# EAGLE design ardSCSInoV2 (EAGLE 7.7.0)
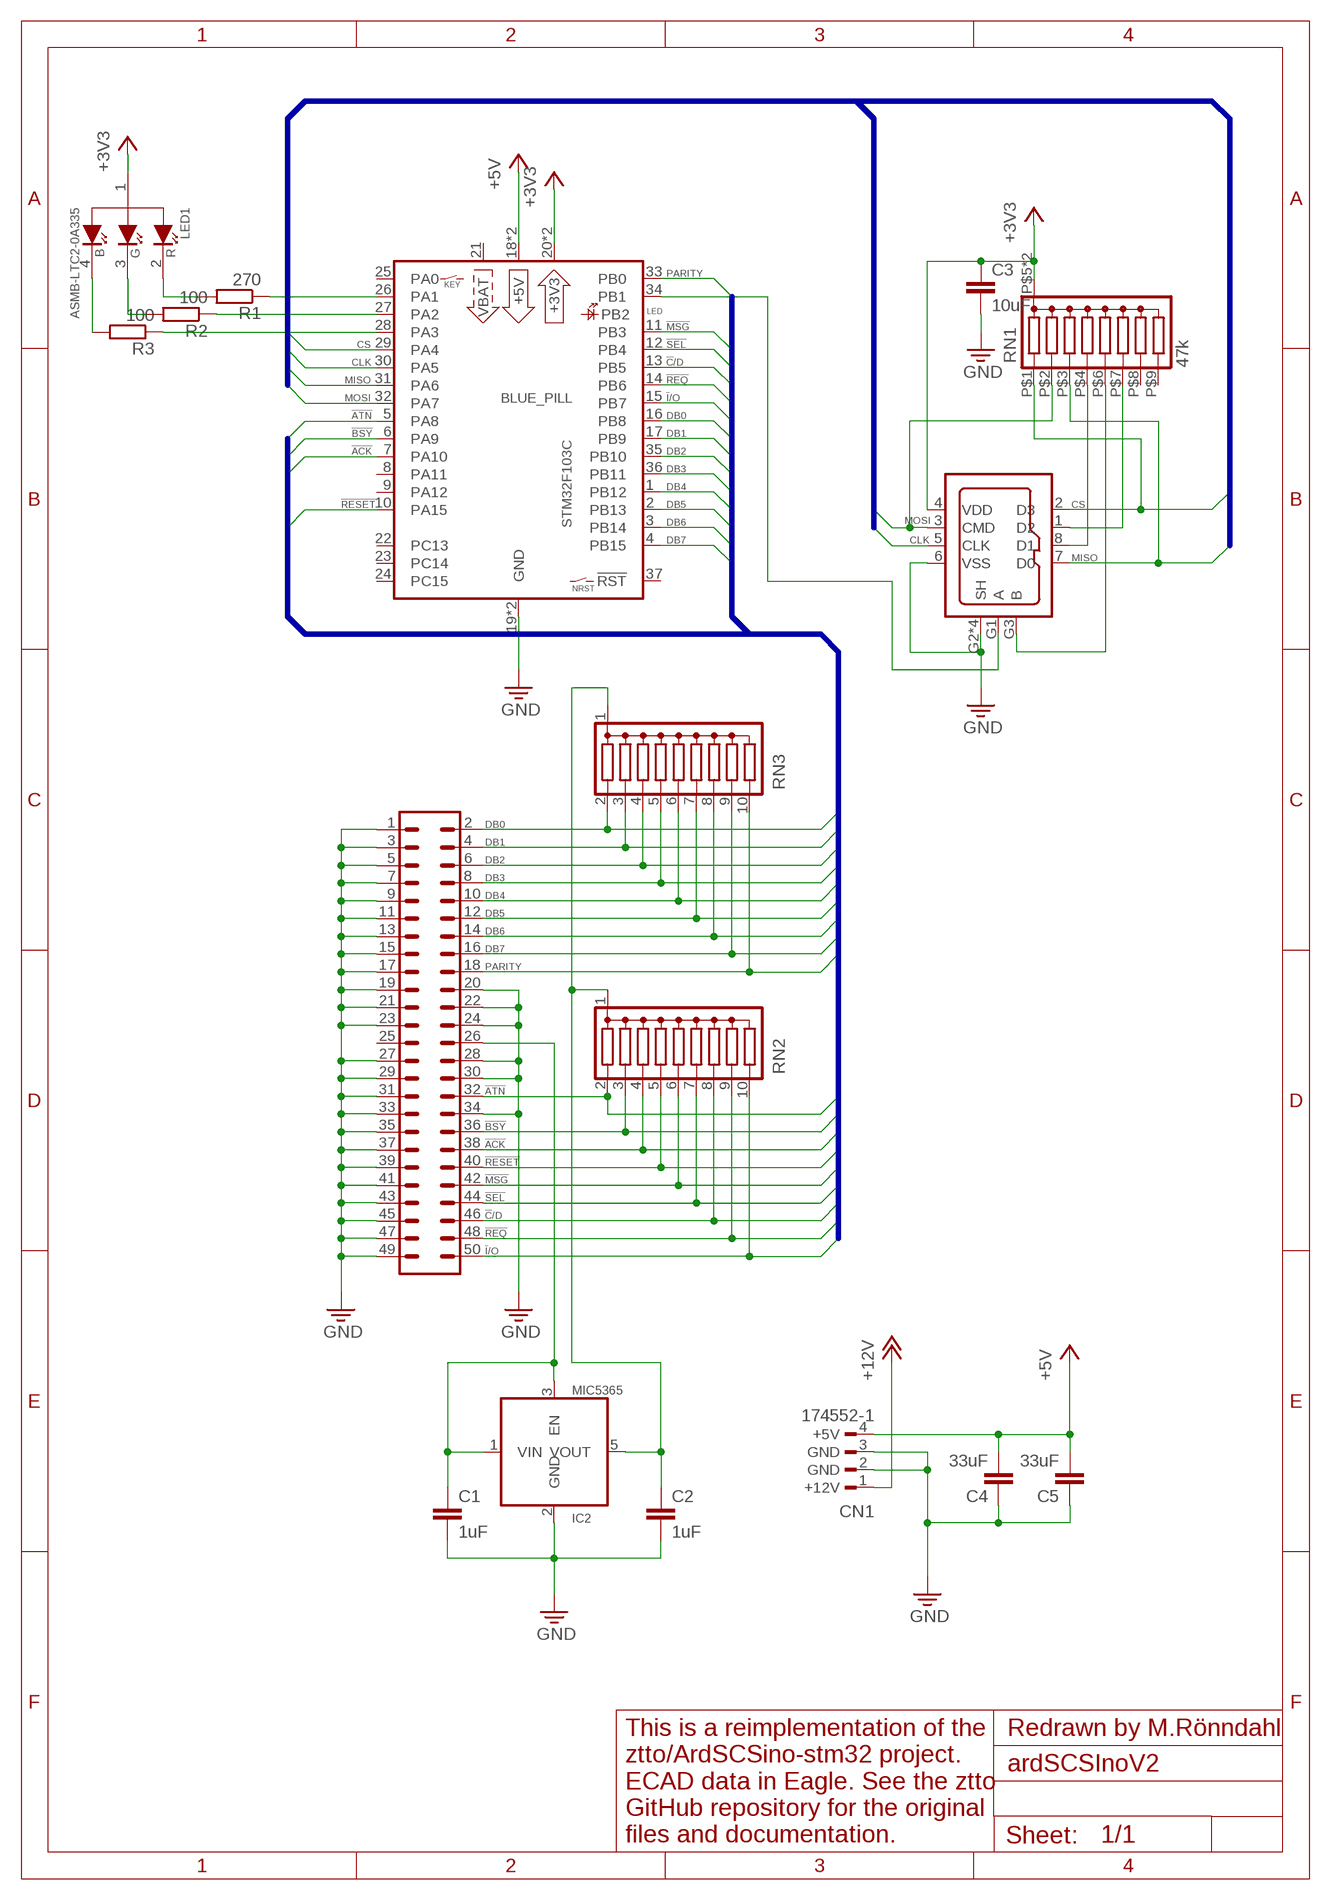
[diagram p0: schematic, sheet 1]

## Parts
BLUE_PILL  STM32F103C  [B-PILL]
C1  1uF  C-EUC0805  [C0805]
C2  1uF  C-EUC0805  [C0805]
C3  10uF  C-EUC0805  [C0805]
C4  33uF  C-EUC0805  [C0805]
C5  33uF  C-EUC0805  [C0805]
CN1  174552-1  [174552-1]
CN2  30350-5002HB  [30350-5002]
CN3  DM3AT-SF-PEJM5-PD  [DM3AT-CL609]
IC2  MIC5365  [SOT23-5]
LED1  ASMB-LTC2-0A335  [PLCC-4_BROADCOM]
R1  270  R-EU_R0603  [R0603]
R2  100  R-EU_R0603  [R0603]
R3  100  R-EU_R0603  [R0603]
RN1  47k  EXB-A10P  [PANAS-2512]
RN2  RNY9  [RN-10]
RN3  RNY9  [RN-10]

## Nets
!ACK: BLUE_PILL.7(PA10) CN2.38 RN2.4
!ATN: BLUE_PILL.5(PA8) CN2.32 RN2.2
!BSY: BLUE_PILL.6(PA9) CN2.36 RN2.3
!C!/D: BLUE_PILL.13(PB5) CN2.46 RN2.8
!I!/O: BLUE_PILL.15(PB7) CN2.50 RN2.10
!MSG: BLUE_PILL.11(PB3) CN2.42 RN2.6
!REQ: BLUE_PILL.14(PB6) CN2.48 RN2.9
!RESET: BLUE_PILL.10(PA15) CN2.40 RN2.5
!SEL: BLUE_PILL.12(PB4) CN2.44 RN2.7
+3V3: BLUE_PILL.20(+3V3) BLUE_PILL.38(+3V3) C3.1 CN3.4(VDD) LED1.1(CA) RN1.P$5(C) RN1.P$10(C)
+5V: BLUE_PILL.18(+5V) BLUE_PILL.40(+5V) C4.2 C5.2 CN1.4(+5V)
+12V: CN1.1(+12V)
B: BLUE_PILL.28(PA3) R3.1
CLK: BLUE_PILL.30(PA5) CN3.5(CLK)
CS: BLUE_PILL.29(PA4) CN3.2(D3) RN1.P$1
DB0: BLUE_PILL.16(PB8) CN2.2 RN3.2
DB1: BLUE_PILL.17(PB9) CN2.4 RN3.3
DB2: BLUE_PILL.35(PB10) CN2.6 RN3.4
DB3: BLUE_PILL.36(PB11) CN2.8 RN3.5
DB4: BLUE_PILL.1(PB12) CN2.10 RN3.6
DB5: BLUE_PILL.2(PB13) CN2.12 RN3.7
DB6: BLUE_PILL.3(PB14) CN2.14 RN3.8
DB7: BLUE_PILL.4(PB15) CN2.16 RN3.9
G: BLUE_PILL.27(PA2) R2.1
GND: BLUE_PILL.19(GND) BLUE_PILL.39(GND) C1.2 C2.2 C3.2 C4.1 C5.1 CN1.2(GND) CN1.3(GND) CN2.1 CN2.3 CN2.5 CN2.7 CN2.9 CN2.11 CN2.13 CN2.15 CN2.17 CN2.19 CN2.20 CN2.21 CN2.22 CN2.23 CN2.24 CN2.27 CN2.28 CN2.29 CN2.30 CN2.31 CN2.33 CN2.34 CN2.35 CN2.37 CN2.39 CN2.41 CN2.43 CN2.45 CN2.47 CN2.49 CN3.6(VSS) CN3.G2(SH) CN3.G4(SH) CN3.G5(SH) CN3.G6(SH) IC2.2(GND)
MISO: BLUE_PILL.31(PA6) CN3.7(D0) RN1.P$3
MOSI: BLUE_PILL.32(PA7) CN3.3(CMD) RN1.P$2
N$4: CN3.8(D1) RN1.P$4
N$5: CN3.1(D2) RN1.P$7
N$6: CN3.G3(B) RN1.P$6
N$7: BLUE_PILL.34(PB1) CN3.G1(A)
N$9: LED1.4(B) R3.2
N$10: LED1.3(G) R2.2
N$11: LED1.2(R) R1.2
PARITY: BLUE_PILL.33(PB0) CN2.18 RN3.10
R: BLUE_PILL.26(PA1) R1.1
TRMPWR: C1.1 CN2.26 IC2.1(VIN) IC2.3(EN)
VOUT: C2.1 IC2.5(VOUT) RN2.1(C) RN3.1(C)
Unconnected: BLUE_PILL.8(PA11) BLUE_PILL.9(PA12) BLUE_PILL.22(PC13) BLUE_PILL.23(PC14) BLUE_PILL.24(PC15) BLUE_PILL.25(PA0) BLUE_PILL.37(!RST) CN2.25 RN1.P$8 RN1.P$9

## Buses
SCSI:DB[0..7],PARITY,!ATN,!BSY,!ACK,!RESET,!MSG,!SEL,!C!/D,!REQ,!I!/O
SD:CS,CLK,MOSI,MISO

## Notes on the sheet
- Redrawn by M.Rönndahl
- This is a reimplementation of the
  ztto/ArdSCSino-stm32 project. 
  ECAD data in Eagle. See the ztto
  GitHub repository for the original
  files and documentation.

## Power pins joined to a net without a drawn wire
VBAT: BLUE_PILL.21(VBAT)

## Library data of the parts
BLUE_PILL = micro-st:STM32F103C: WeAct BluePill-Plus https://github.com/WeActTC/BluePill-Plus.git
C1-C5 = rcl:C-EU: CAPACITOR, European symbol
CN1 = con-amp:174552-1: 4-pin Hard disk power connector
CN2 = con-various:30350: 3M pin header 50-pin series 303 contact pc board low profile headers; OC_FARNELL: unknown; OC_NEWARK: unknown
CN3 = con-hirose:DM3AT-SF-PEJM5-PD: DM3 Series microSD Card Connector Push - Push, with ejection mechanism and presence detection (A-B)
IC2 = micrel:MIC5365: Fixed Voltage Regulators
LED1 = my_leds:ASMB-LTC2: 2121 Tricolor PLCC-4 LED
R1-R3 = rcl:R-EU_: RESISTOR, European symbol
RN1 = resistor-net:EXB-A10P: 8-resistor bussed network
RN2 RN3 = resistor-net:RNY9: 9-resistor bussed network

## Board
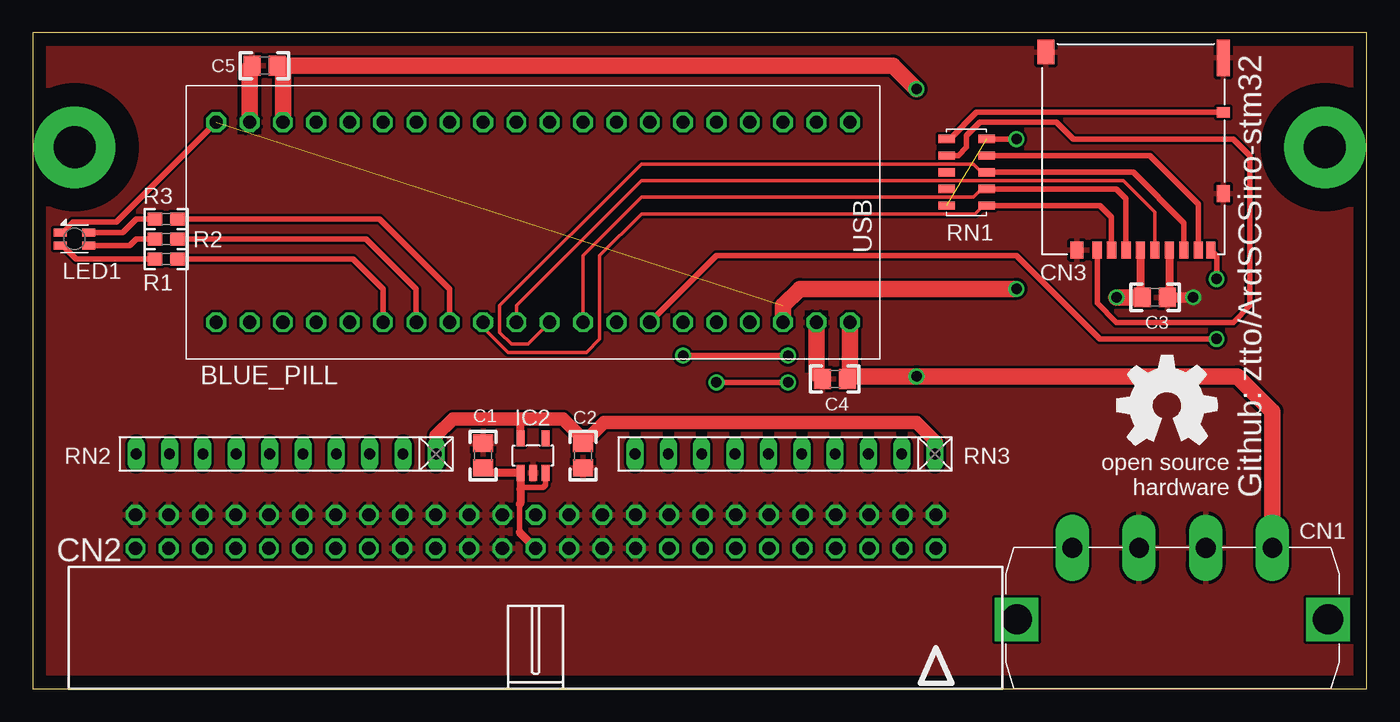
[diagram p1: board, top side]
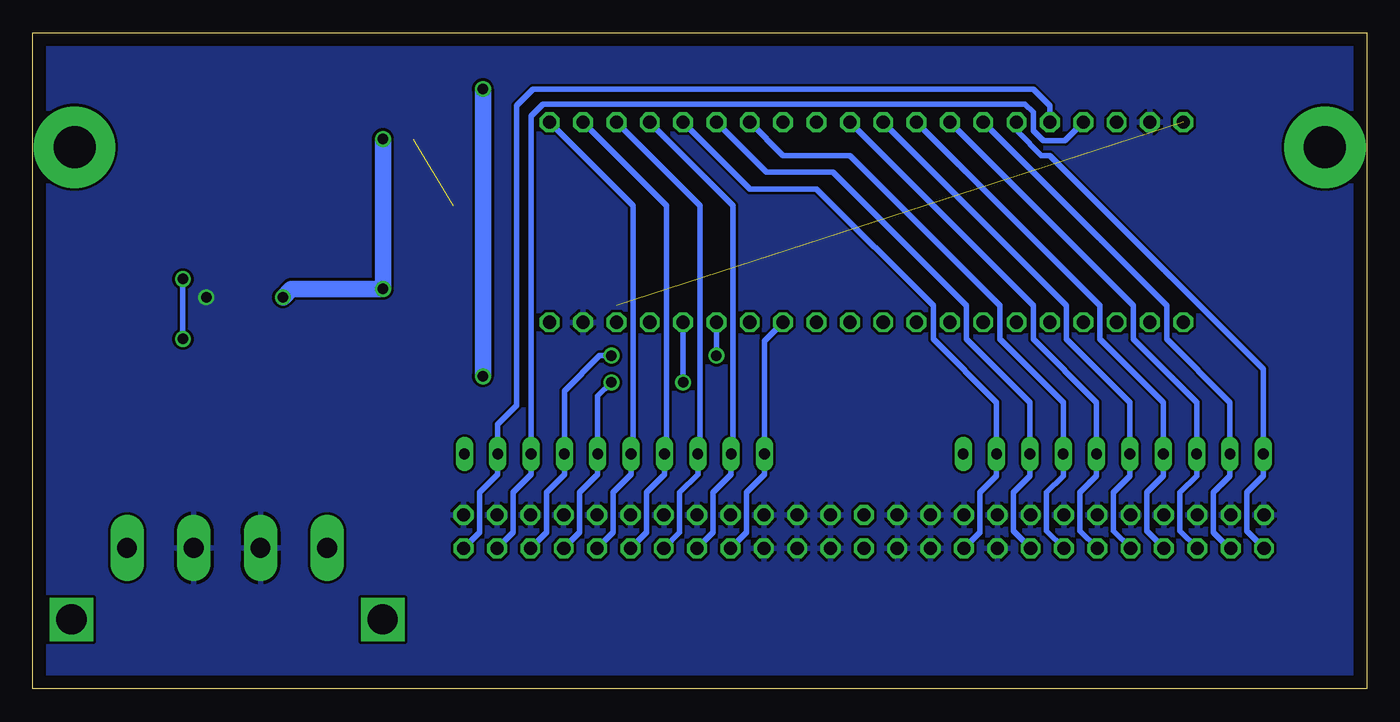
[diagram p2: board, bottom side, seen from below]

Size 101.6 x 50 mm. Coordinates in mm from the lower left corner, seen from the top.
Outline: 0,0 101.6,0 101.6,50 0,50 0,0
Copper layers (1*16): Top 0.035mm / dielectric 1.5mm / Bottom 0.035mm
Design rules "default": minimum track width 10mil, minimum drill 24mil, track to track 8mil, track to pad 8mil, pad to pad 8mil, via to via 8mil, smd to smd 8mil, copper to edge 40mil, drill to drill 8mil, minimum pad ring 10mil, minimum via ring 8mil, stop-mask expansion 4mil, vias tented up to drill 0mil, thermal gap 10mil
tRestrict: area 58.8,24.1 to 60.6,28.8; area 15.6,42.3 to 17.4,47.1; area 86,30.5 to 87.1,34.4; area -1.4,36.7 to 7.8,45.9; area 93.9,36.7 to 103,45.9

### Footprints (pad centres in the part's own frame; a part is rotated, then mirrored left to right if it is on the bottom)
B-PILL = drill 1 octagon: 1 -24.13,-7.62; 2 -21.59,-7.62; 3 -19.05,-7.62; 4 -16.51,-7.62; 5 -13.97,-7.62; 6 -11.43,-7.62; 7 -8.89,-7.62; 8 -6.35,-7.62; 9 -3.81,-7.62; 10 -1.27,-7.62; 11 1.27,-7.62; 12 3.81,-7.62; 13 6.35,-7.62; 14 8.89,-7.62; 15 11.43,-7.62; 16 13.97,-7.62; 17 16.51,-7.62; 18 19.05,-7.62; 19 21.59,-7.62; 20 24.13,-7.62; 21 24.13,7.62; 22 21.59,7.62; 23 19.05,7.62; 24 16.51,7.62; 25 13.97,7.62; 26 11.43,7.62; 27 8.89,7.62; 28 6.35,7.62; 29 3.81,7.62; 30 1.27,7.62; 31 -1.27,7.62; 32 -3.81,7.62; 33 -6.35,7.62; 34 -8.89,7.62; 35 -11.43,7.62; 36 -13.97,7.62; 37 -16.51,7.62; 38 -19.05,7.62; 39 -21.59,7.62; 40 -24.13,7.62
C0805 = smd 1.3 x 1.5: 1 -0.95,0; 2 0.95,0
174552-1 = drill 1.5 pad 2.54 long: 1 7.62,-10.75; 2 2.54,-10.75; 3 -2.54,-10.75; 4 -7.62,-10.75 | drill 2.3 square: P0 -11.85,-5.3; P1 11.85,-5.3
30350-5002 = drill 1 octagon: 1 -30.48,-13.26; 2 -30.48,-10.72; 3 -27.94,-13.26; 4 -27.94,-10.72; 5 -25.4,-13.26; 6 -25.4,-10.72; 7 -22.86,-13.26; 8 -22.86,-10.72; 9 -20.32,-13.26; 10 -20.32,-10.72; 11 -17.78,-13.26; 12 -17.78,-10.72; 13 -15.24,-13.26; 14 -15.24,-10.72; 15 -12.7,-13.26; 16 -12.7,-10.72; 17 -10.16,-13.26; 18 -10.16,-10.72; 19 -7.62,-13.26; 20 -7.62,-10.72; 21 -5.08,-13.26; 22 -5.08,-10.72; 23 -2.54,-13.26; 24 -2.54,-10.72; 25 0,-13.26; 26 0,-10.72; 27 2.54,-13.26; 28 2.54,-10.72; 29 5.08,-13.26; 30 5.08,-10.72; 31 7.62,-13.26; 32 7.62,-10.72; 33 10.16,-13.26; 34 10.16,-10.72; 35 12.7,-13.26; 36 12.7,-10.72; 37 15.24,-13.26; 38 15.24,-10.72; 39 17.78,-13.26; 40 17.78,-10.72; 41 20.32,-13.26; 42 20.32,-10.72; 43 22.86,-13.26; 44 22.86,-10.72; 45 25.4,-13.26; 46 25.4,-10.72; 47 27.94,-13.26; 48 27.94,-10.72; 49 30.48,-13.26; 50 30.48,-10.72
DM3AT-CL609 = smd 0.7 x 1.3: 1 2.75,7.2; 2 1.65,7.2; 3 0.55,7.2; 4 -0.55,7.2; 5 -1.65,7.2; 6 -2.75,7.2; 7 -3.85,7.2; 8 -4.95,7.2; G1 -5.9,7.2 | smd 1 x 1.3: G2 -6.85,2.9; G6 4.3,7.2 | smd 1 x 0.8: G3 -6.85,-3.3 | smd 1 x 2.8: G4 -6.85,-7.45 | smd 1.3 x 1.9: G5 6.65,-7.9
SOT23-5 = smd 0.6 x 1.2: 1 -0.95,-1.306; 2 0,-1.306; 3 0.95,-1.306; 4 0.95,1.306; 5 -0.95,1.306
PLCC-4_BROADCOM = smd 1 x 0.6: 1 1.092,-0.496; 2 1.092,0.496; 3 -1.092,0.496; 4 -1.092,-0.496
R0603 = smd 1.1 x 1: 1 -0.85,0; 2 0.85,0
PANAS-2512 = smd 0.635 x 1.27: P$1 -2.54,-1.524; P$2 -1.27,-1.524; P$3 0,-1.524; P$4 1.27,-1.524; P$5 2.54,-1.524; P$6 2.54,1.524; P$7 1.27,1.524; P$8 0,1.524; P$9 -1.27,1.524; P$10 -2.54,1.524
RN-10 = drill 0.813 long: 1 -11.43,0; 2 -8.89,0; 3 -6.35,0; 4 -3.81,0; 5 -1.27,0; 6 1.27,0; 7 3.81,0; 8 6.35,0; 9 8.89,0; 10 11.43,0

### Placement (x,y rotation side)
BLUE_PILL  38.1,35.56 180 top
C1  34.29,17.78 90 top
C2  41.91,17.78 270 top
C3  85.47,29.84 0 top
C4  61.09,23.62 0 top
C5  17.65,47.5 0 top
CN1  86.8,0 180 top
CN2  38.3,0 180 top
CN3  83.82,40.64 180 top
IC2  38.1,17.78 0 top
LED1  3.17,34.29 180 top
R1  10.16,32.77 180 top
R2  10.16,34.29 180 top
R3  10.16,35.81 180 top
RN1  71.12,39.37 90 top
RN2  19.3,17.91 180 top
RN3  57.3,17.91 180 top
U$2  [OSHW_8MM]  86.36,21.59 0 top

### Tracks (layer width: path | path; a pad name or v marks a point on that pad's centre or on a via)
!ACK
  Bottom 0.406: CN2.38 23.06,10.74 24.38,12.06 24.38,14.99 23.11,16.26 RN2.4 23.11,21.84 27.94,26.67 27.94,29.21 39.37,40.64 44.45,40.64 BLUE_PILL.7
!ATN
  Bottom 0.406: CN2.32 29.46,11.94 29.46,14.99 28.19,16.26 RN2.2 28.19,21.84 33.02,26.67 33.02,29.21 41.91,38.1 46.99,38.1 BLUE_PILL.5
!BSY
  Bottom 0.406: CN2.36 25.6,10.74 26.92,12.06 26.92,14.99 25.65,16.26 RN2.3 25.65,21.84 30.48,26.67 30.48,29.21 40.64,39.37 45.72,39.37 BLUE_PILL.6
!C!/D
  Bottom 0.406: CN2.46 12.9,10.74 14.22,12.06 14.22,14.99 12.95,16.26 RN2.8 12.95,21.84 17.78,26.67 17.78,29.21 BLUE_PILL.13
!I!/O
  Bottom 0.406: CN2.50 7.82,10.74 9.14,12.06 9.14,14.99 7.87,16.26 RN2.10 7.87,24.38 24.13,40.64 24.77,40.64 26.54,42.42 26.54,43.05 BLUE_PILL.15
!MSG
  Bottom 0.406: CN2.42 17.98,10.74 19.3,12.06 19.3,14.99 18.03,16.26 RN2.6 18.03,21.84 22.86,26.67 22.86,29.21 BLUE_PILL.11
!REQ
  Bottom 0.406: CN2.48 10.47,10.72 11.68,11.94 11.68,14.99 10.41,16.26 RN2.9 10.41,21.84 15.24,26.67 15.24,29.21 BLUE_PILL.14
!RESET
  Bottom 0.406: CN2.40 20.52,10.74 21.84,12.06 21.84,14.99 20.57,16.26 RN2.5 20.57,21.84 25.4,26.67 25.4,29.21 BLUE_PILL.10
!SEL
  Bottom 0.406: CN2.44 15.44,10.74 16.76,12.06 16.76,14.99 15.49,16.26 RN2.7 15.49,21.84 20.32,26.67 20.32,29.21 BLUE_PILL.12
+3V3  (via drill 0.8)  (2 unrouted)
  Top 0.406: RN1.P$5 v74.93,41.91 | LED1.1 2.27,34.79 3.05,35.56 6.35,35.56 BLUE_PILL.20
  Top 0.61: CN3.4 84.37,30 C3.1
  Top 1.27: v82.55,29.84 C3.1 | BLUE_PILL.38 57.15,29.21 58.42,30.48 v74.93,30.48
  Bottom 1.27: v82.55,29.84 81.92,30.48 v74.93,30.48 v74.93,41.91
+5V  (via drill 0.8)
  Top 1.27: 62.23,23.82 v67.31,23.82 91.75,23.82 94.42,21.15 CN1.4 | v67.31,45.72 65.53,47.5 C5.2 19.05,47.05 BLUE_PILL.18 | BLUE_PILL.40 62.23,23.82 | 62.23,23.82 C4.2
  Bottom 1.27: v67.31,45.72 v67.31,23.82
B
  Top 0.406: R3.1 26.42,35.81 31.75,30.48 BLUE_PILL.28
CLK
  Top 0.254: CN3.5 85.47,36.32 83.06,38.73 46.35,38.73 36.83,29.21 BLUE_PILL.30
CS
  Top 0.254: RN1.P$1 72.39,36.83 71.75,36.2 46.35,36.2 43.18,33.02 43.18,26.67 42.16,25.65 36.2,25.65 34.29,27.56 BLUE_PILL.29
  Top 0.406: CN3.2 82.17,35.94 81.28,36.83 RN1.P$1
DB0
  Bottom 0.406: CN2.2 67.56,11.94 67.56,14.99 66.19,16.36 RN3.2 66.19,20.17 64.77,21.59 64.77,44.45 63.5,45.72 25.4,45.72 24.13,44.45 BLUE_PILL.16
DB1
  Bottom 0.406: CN2.4 65.02,11.94 65.02,14.99 63.65,16.36 RN3.3 63.65,43.66 62.74,44.58 26.04,44.58 25.4,43.94 25.4,42.55 24.64,41.78 22.99,41.78 BLUE_PILL.17
DB2  (via drill 0.8)
  Top 0.406: v57.53,25.4 v49.53,25.4
  Bottom 0.406: CN2.6 62.48,11.94 62.48,14.99 61.11,16.36 RN3.4 61.11,22.71 58.42,25.4 v57.53,25.4 | v49.53,25.4 BLUE_PILL.35
DB3  (via drill 0.8)
  Top 0.406: v57.53,23.37 v52.07,23.37
  Bottom 0.406: CN2.8 59.94,11.94 59.94,14.99 58.57,16.36 RN3.5 58.57,22.33 v57.53,23.37 | v52.07,23.37 BLUE_PILL.36
DB4
  Bottom 0.406: CN2.10 57.4,11.94 57.4,14.99 56.03,16.36 RN3.6 55.88,18.06 55.88,36.83 BLUE_PILL.1
DB5
  Bottom 0.406: CN2.12 54.86,11.94 54.86,14.99 53.49,16.36 RN3.7 53.34,18.06 53.34,36.83 BLUE_PILL.2
DB6
  Bottom 0.406: CN2.14 52.32,11.94 52.32,14.99 50.95,16.36 RN3.8 50.8,18.06 50.8,36.83 BLUE_PILL.3
DB7
  Bottom 0.406: CN2.16 49.78,11.94 49.78,14.99 48.41,16.36 RN3.9 48.26,18.06 48.26,36.83 BLUE_PILL.4
G
  Top 0.406: R2.1 25.4,34.29 29.21,30.48 BLUE_PILL.27
GND  (via drill 0.8)
  Top 0.61: CN3.6 86.57,29.99 C3.2
  Top 0.813: v88.39,29.84 C3.2
  Top 1.27: BLUE_PILL.19 16.51,47.3 C5.1 | BLUE_PILL.39 59.69,24.07 C4.1
  pour Top: 0,0 0,49.53 101.6,49.53 101.6,0
  pour Bottom: 0,0 0,49.53 101.6,49.53 101.6,0
MISO
  Top 0.254: RN1.P$3 72.26,39.37 71.63,40.01 46.35,40.01 35.56,29.21 35.56,27.18 36.45,26.29 37.72,26.29 BLUE_PILL.31
  Top 0.406: CN3.7 87.67,35.52 83.82,39.37 RN1.P$3
MOSI
  Top 0.254: RN1.P$2 72.26,38.1 71.63,37.47 46.35,37.47 41.91,33.02 BLUE_PILL.32
  Top 0.406: CN3.3 83.27,37.38 82.55,38.1 RN1.P$2
N$1  (via drill 0.6)
  other vias: 11.43,162.56
N$2  (via drill 3.2 pad 6.2)
  other vias: 98.42,41.28
N$3  (via drill 3.2 pad 6.2)
  other vias: 3.18,41.28
N$4
  Top 0.406: CN3.8 88.77,36.96 85.09,40.64 RN1.P$4
N$5
  Top 0.406: CN3.1 81.07,29.42 82.55,27.94 91.44,27.94 92.71,29.21 92.71,40.64 91.44,41.91 79.25,41.91 77.98,43.18 72.14,43.18 71.12,42.16 71.12,41.27 70.48,40.64 RN1.P$7
N$6
  Top 0.406: CN3.G3 71.88,43.94 69.85,41.91 RN1.P$6
N$7  (via drill 0.8)
  Top 0.406: BLUE_PILL.34 52.07,33.02 74.93,33.02 81.28,26.67 v90.17,26.67 | v90.17,31.24 90.17,32.99 CN3.G1
  Bottom 0.406: v90.17,26.67 v90.17,31.24
N$9
  Top 0.406: LED1.4 6.85,34.79 7.87,35.81 R3.2
N$10
  Top 0.406: R2.2 7.87,34.29 7.37,33.78 5.55,33.78 LED1.3
N$11
  Top 0.406: LED1.2 2.27,33.79 3.3,32.77 R1.2
PARITY
  Bottom 0.406: CN2.18 47.24,11.94 47.24,14.99 45.87,16.36 RN3.10 45.87,26.52 BLUE_PILL.33
R
  Top 0.406: R1.1 24.38,32.77 26.67,30.48 BLUE_PILL.26
TRMPWR
  Top 0.406: 34.65,16.47 C1.1 | 37.08,11.94 37.08,14.1 | IC2.3 39.05,15.55 38.86,15.37 37.28,15.37 37.15,15.24
  Top 0.61: 34.65,16.47 IC2.1 37.15,15.24 37.15,14.16 37.08,14.1 | CN2.26 37.08,11.94
VOUT
  Top 0.61: IC2.5 37.15,20.25 36.83,20.57
  Top 1.016: RN2.1 30.73,19.3 32,20.57 36.83,20.57 40.39,20.57 41.91,19.05 C2.1 43.5,20.32 67.31,20.32 68.83,18.8 RN3.1

### Text on the board
tPlace: Github: ztto/ArdSCSino-stm32